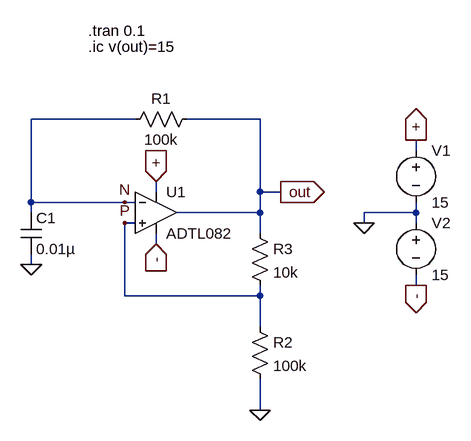
[diagram p0: schematic Digital Oscillator.asc]
Digital Oscillator.asc, the LTspice schematic file:
Version 4
SHEET 1 880 680
WIRE 144 16 -16 16
WIRE 336 16 224 16
WIRE 576 64 576 48
WIRE 176 128 176 112
WIRE 336 128 336 16
WIRE 368 128 336 128
WIRE -16 144 -16 16
WIRE 128 144 -16 144
WIRE 144 144 128 144
WIRE -16 160 -16 144
WIRE 336 160 336 128
WIRE 336 160 208 160
WIRE 576 160 576 144
WIRE 576 160 496 160
WIRE 144 176 128 176
WIRE 496 176 496 160
WIRE 576 176 576 160
WIRE 336 192 336 160
WIRE 176 208 176 192
WIRE -16 240 -16 224
WIRE 576 272 576 256
WIRE 128 288 128 176
WIRE 336 288 336 272
WIRE 336 288 128 288
WIRE 336 336 336 288
WIRE 336 464 336 416
FLAG 576 48 +
IOPIN 576 48 Out
FLAG 576 272 -
IOPIN 576 272 Out
FLAG 496 176 0
FLAG 176 112 +
IOPIN 176 112 In
FLAG 176 208 -
IOPIN 176 208 In
FLAG 336 464 0
FLAG 368 128 out
IOPIN 368 128 Out
FLAG -16 240 0
FLAG 128 144 N
FLAG 128 176 P
SYMBOL res 320 320 R0
SYMATTR InstName R2
SYMATTR Value 100k
SYMATTR SpiceLine tol=5 pwr=0.25
SYMBOL voltage 576 48 R0
WINDOW 123 0 0 Left 0
WINDOW 39 0 0 Left 0
SYMATTR InstName V1
SYMATTR Value 15
SYMBOL voltage 576 160 R0
WINDOW 123 0 0 Left 0
WINDOW 39 0 0 Left 0
SYMATTR InstName V2
SYMATTR Value 15
SYMBOL cap -32 160 R0
SYMATTR Value 0.01µ
SYMATTR InstName C1
SYMATTR SpiceLine V=50 Irms=160m Rser=0.444602 Lser=0 mfg="KEMET" pn="C1812C103K5RAC" type="X7R"
SYMBOL Opamps\\ADTL082 176 96 R0
SYMATTR InstName U1
SYMBOL res 240 0 R90
WINDOW 0 0 56 VBottom 2
WINDOW 3 32 56 VTop 2
SYMATTR InstName R1
SYMATTR Value 100k
SYMATTR SpiceLine tol=5 pwr=0.25
SYMBOL res 320 176 R0
SYMATTR InstName R3
SYMATTR Value 10k
SYMATTR SpiceLine tol=5 pwr=0.25
TEXT 72 -120 Left 2 !.tran 0.1
TEXT 72 -96 Left 2 !.ic v(out)=15

The netlist it stands for:
* Digital Oscillator.asc
R2 P 0 100k tol=5 pwr=0.25
V1 + 0 15
V2 0 - 15
C1 N 0 0.01µ V=50 Irms=160m Rser=0.444602 Lser=0 mfg="KEMET" pn="C1812C103K5RAC" type="X7R"
XU1 P N + - out ADTL082  ; pins In+ In- V+ V- OUT
R1 out N 100k tol=5 pwr=0.25
R3 out P 10k tol=5 pwr=0.25
.tran 0.1
.ic v(out)=15
.lib ADI.lib
.backanno
.end